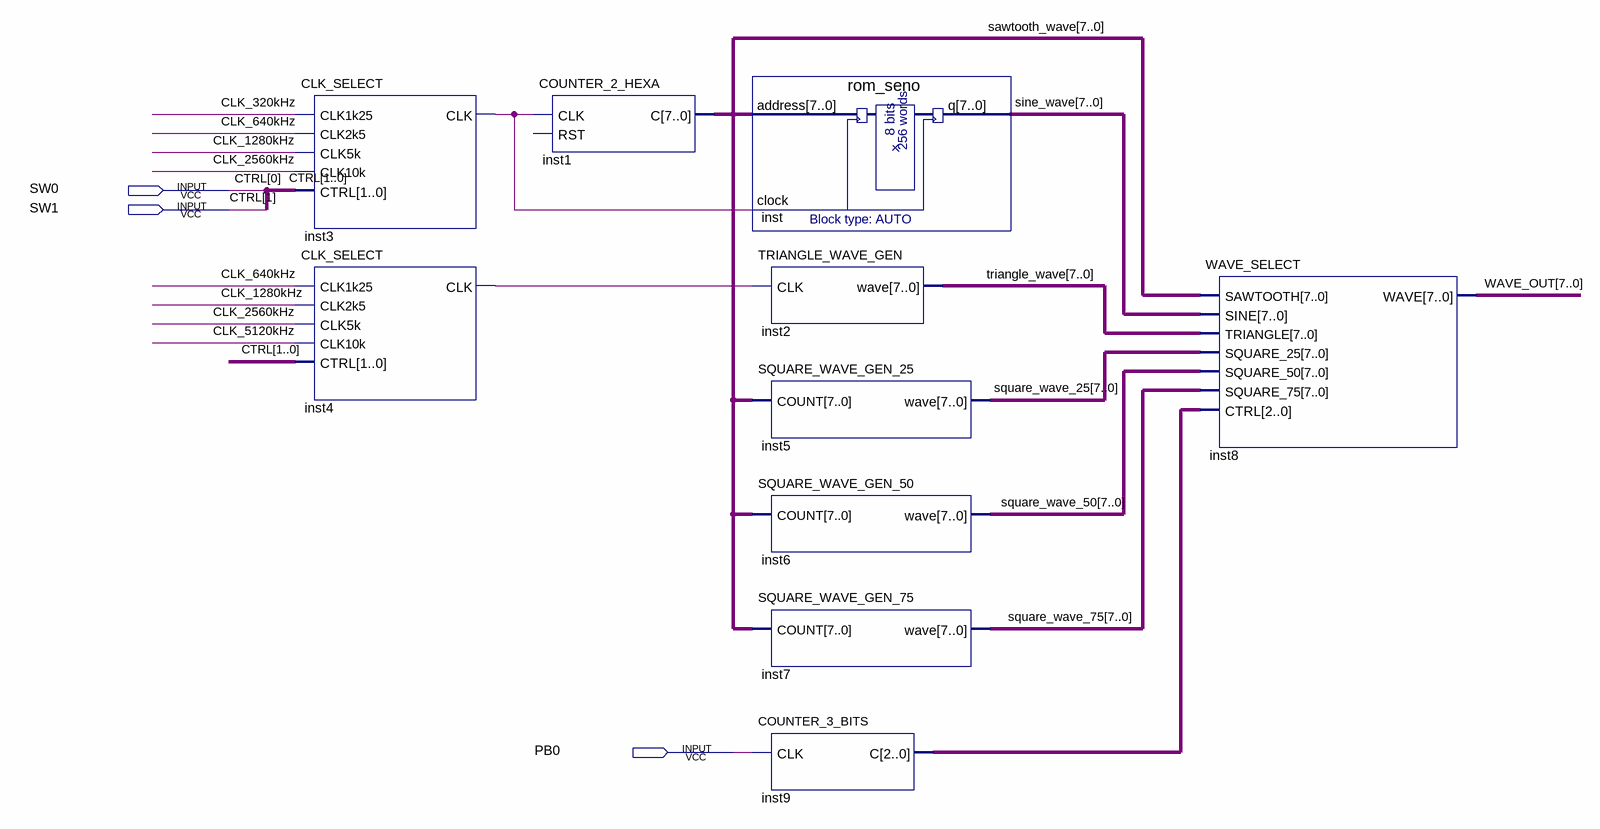
[diagram p0: schematic sheet]
// Quartus schematic main.bdf as structural Verilog: 10 symbols, 3 pins
module main (
  input  SW0,
  input  SW1,
  input  PB0
);

  wire CLK_320kHz, CLK_640kHz, CLK_1280kHz, CLK_2560kHz, CLK_5120kHz, inst3_clk, inst4_clk;
  wire [2:0] inst9_c;
  wire [7:0] sawtooth_wave, sine_wave, square_wave_25, square_wave_50, square_wave_75, triangle_wave,
       WAVE_OUT;

  CLK_SELECT inst3 (
    .CLK1k25(CLK_320kHz), .CLK2k5(CLK_640kHz), .CLK5k(CLK_1280kHz), .CLK10k(CLK_2560kHz), .CTRL({SW1, SW0}),
    .CLK(inst3_clk));
  CLK_SELECT inst4 (
    .CLK1k25(CLK_640kHz), .CLK2k5(CLK_1280kHz), .CLK5k(CLK_2560kHz), .CLK10k(CLK_5120kHz), .CTRL({SW1, SW0}),
    .CLK(inst4_clk));
  COUNTER_2_HEXA inst1 (.CLK(inst3_clk), .C(sawtooth_wave));  // open: RST
  rom_seno inst (.address(sawtooth_wave), .clock(inst3_clk), .q(sine_wave));
  TRIANGLE_WAVE_GEN inst2 (.CLK(inst4_clk), .wave(triangle_wave));
  SQUARE_WAVE_GEN_25 inst5 (.COUNT(sawtooth_wave), .wave(square_wave_25));
  SQUARE_WAVE_GEN_50 inst6 (.COUNT(sawtooth_wave), .wave(square_wave_50));
  SQUARE_WAVE_GEN_75 inst7 (.COUNT(sawtooth_wave), .wave(square_wave_75));
  COUNTER_3_BITS inst9 (.CLK(PB0), .C(inst9_c));
  WAVE_SELECT inst8 (
    .SAWTOOTH(sawtooth_wave), .SINE(sine_wave), .TRIANGLE(triangle_wave), .SQUARE_25(square_wave_25),
    .SQUARE_50(square_wave_50), .SQUARE_75(square_wave_75), .CTRL(inst9_c), .WAVE(WAVE_OUT));

  // Other names for the same wires on the sheet: CTRL[1:0] = {SW1, SW0}
endmodule
